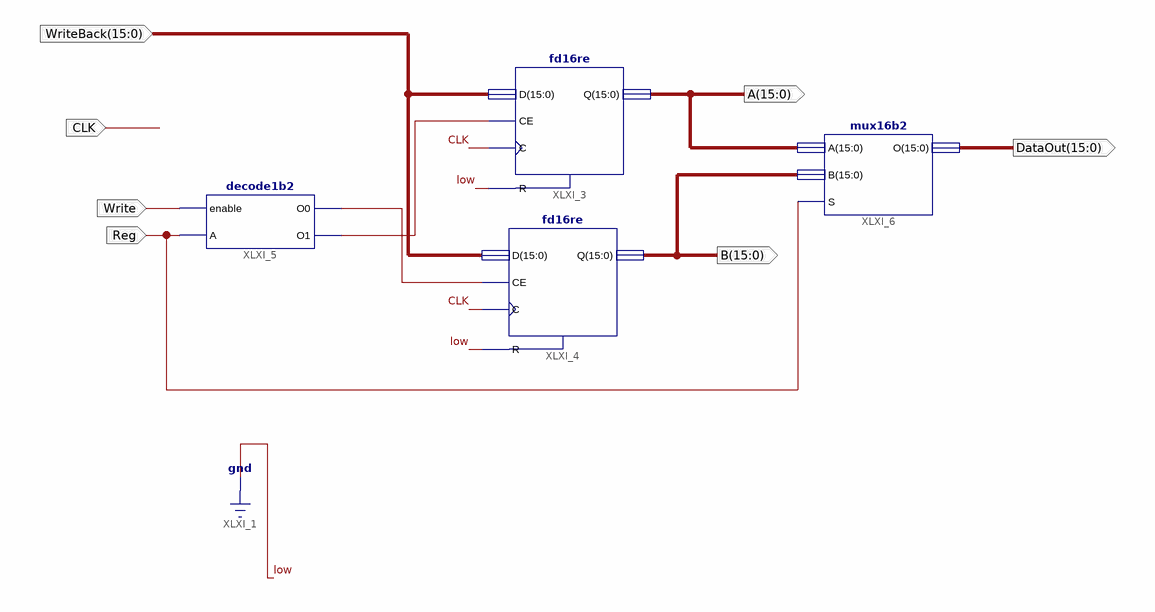
[diagram p0: schematic sheet 1]
// Xilinx ISE schematic regFile16b2.sch (spartan3e) as structural Verilog: 4 symbols, 7 ports
module regFile16b2 (
  input  Write,
  input  CLK,
  input  [15:0] WriteBack,
  input  Reg,
  output [15:0] A,
  output [15:0] B,
  output [15:0] DataOut
);

  wire XLXN_15, XLXN_16;

  fd16re XLXI_3 (.C(CLK), .CE(XLXN_16), .D(WriteBack), .R(1'b0), .Q(A));
  fd16re XLXI_4 (.C(CLK), .CE(XLXN_15), .D(WriteBack), .R(1'b0), .Q(B));
  decode1b2 XLXI_5 (.enable(Write), .A(Reg), .O0(XLXN_15), .O1(XLXN_16));
  mux16b2 XLXI_6 (.A(A), .B(B), .S(Reg), .O(DataOut));
endmodule
